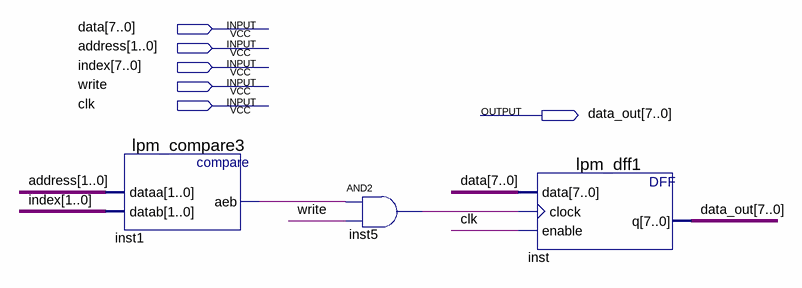
[diagram p0: schematic sheet]
// Quartus schematic Slave.bdf as structural Verilog: 3 symbols, 6 pins
module Slave (
  input  [7:0] data,
  input  [1:0] address,
  input  [7:0] index,
  input  write,
  input  clk,
  output [7:0] data_out
);

  wire inst1_aeb, inst5_out;

  lpm_compare3 inst1 (.dataa(address), .datab(index[1:0]), .aeb(inst1_aeb));
  and inst5 (inst5_out, inst1_aeb, write);
  lpm_dff1 inst (.data(data), .clock(inst5_out), .enable(clk), .q(data_out));
endmodule
